# EAGLE design gator-bit (EAGLE 9.5.2)

## Sheet 1 of 2
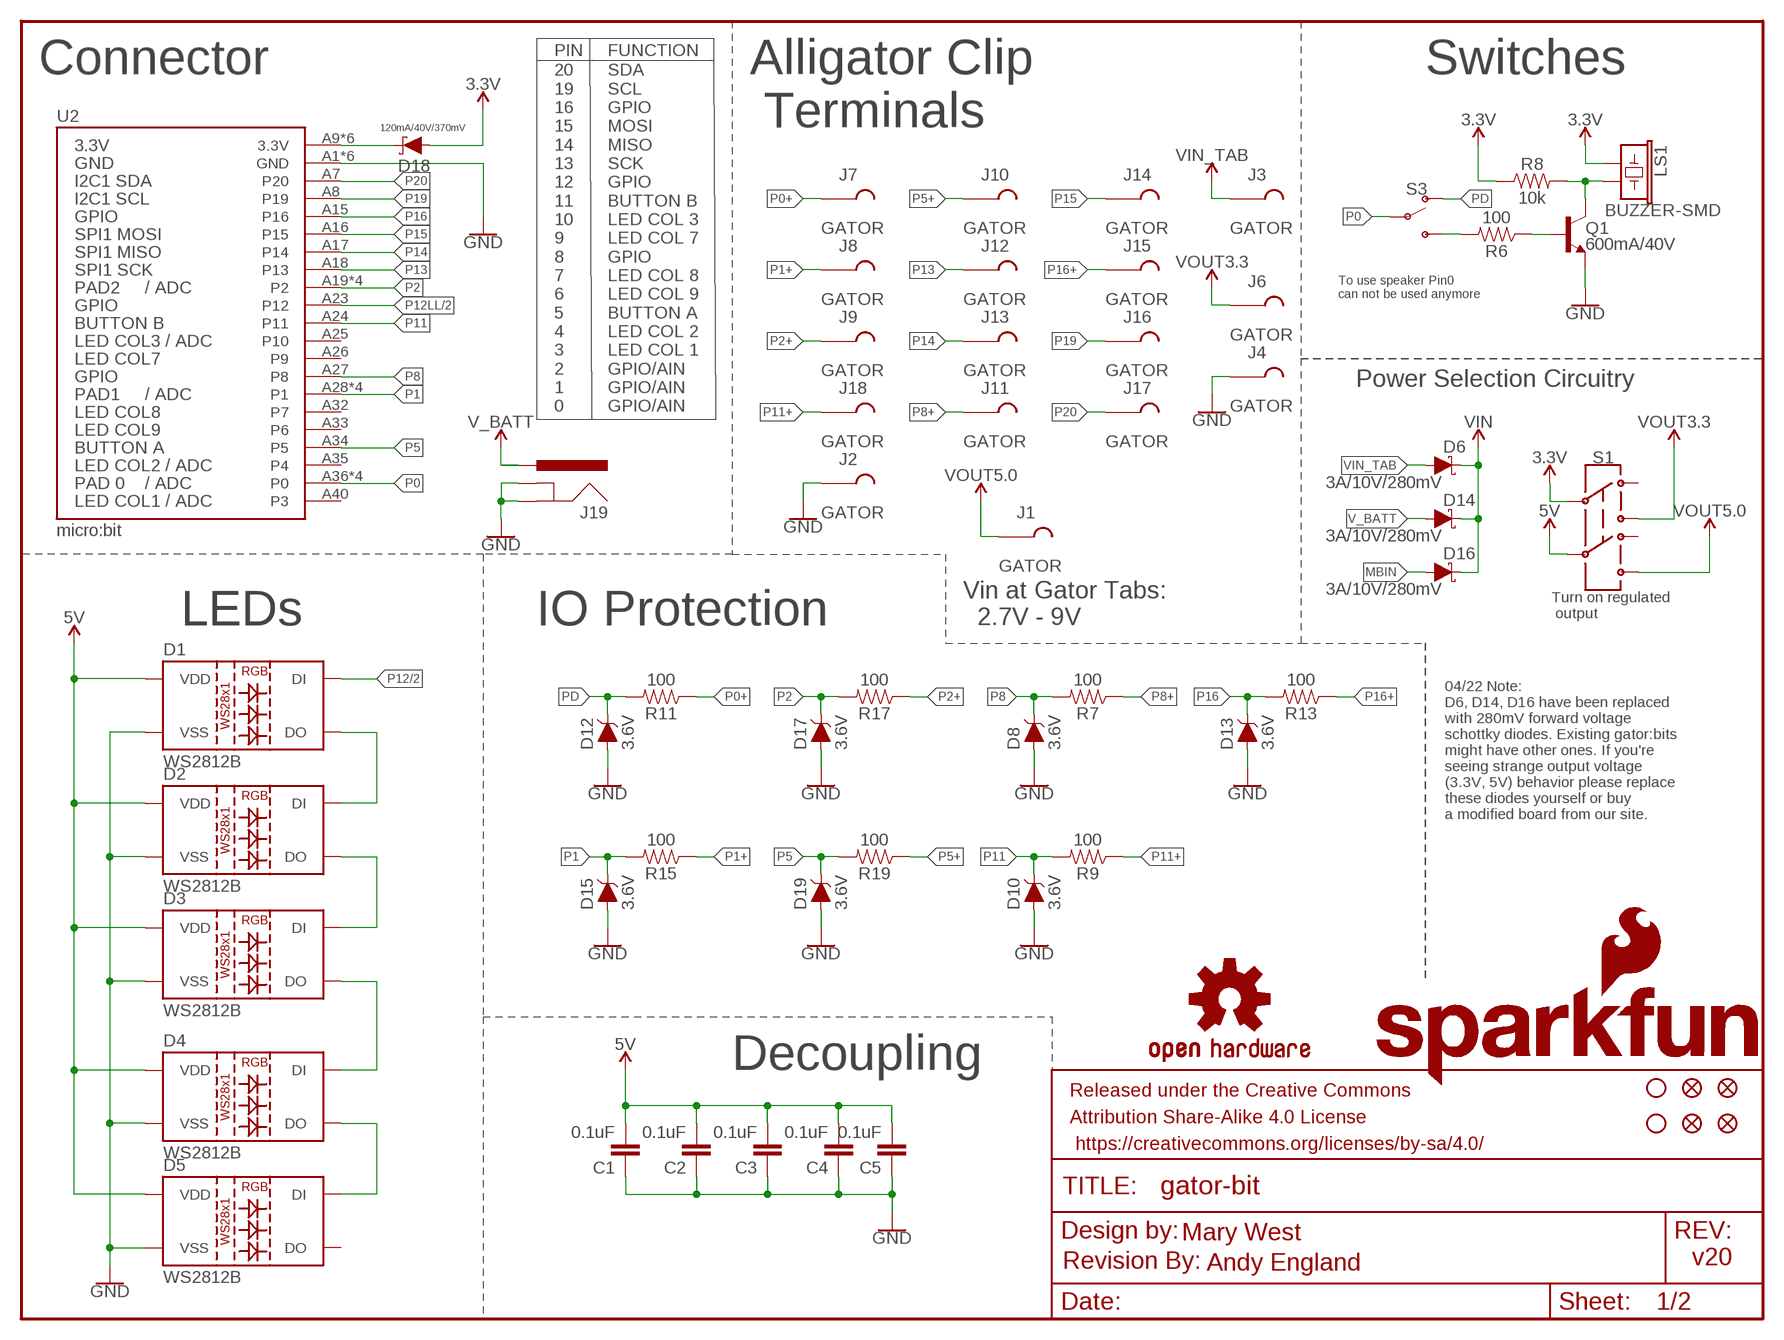
[diagram p0: schematic, sheet 1]

### Parts
C1  0.1uF  0.1UF-0603-25V-(+80/-20%)  [0603]
C2  0.1uF  0.1UF-0603-25V-(+80/-20%)  [0603]
C3  0.1uF  0.1UF-0603-25V-(+80/-20%)  [0603]
C4  0.1uF  0.1UF-0603-25V-(+80/-20%)  [0603]
C5  0.1uF  0.1UF-0603-25V-(+80/-20%)  [0603]
D1  WS2812B  [WS2812B]
D2  WS2812B  [WS2812B]
D3  WS2812B  [WS2812B]
D4  WS2812B  [WS2812B]
D5  WS2812B  [WS2812B]
D6  3A/10V/280mV  DIODE-SCHOTTKY-BAT60A  [SOD-323]
D8  3.6V  DIODE-ZENER-BZT52C3V6S  [SOD-323]
D10  3.6V  DIODE-ZENER-BZT52C3V6S  [SOD-323]
D12  3.6V  DIODE-ZENER-BZT52C3V6S  [SOD-323]
D13  3.6V  DIODE-ZENER-BZT52C3V6S  [SOD-323]
D14  3A/10V/280mV  DIODE-SCHOTTKY-BAT60A  [SOD-323]
D15  3.6V  DIODE-ZENER-BZT52C3V6S  [SOD-323]
D16  3A/10V/280mV  DIODE-SCHOTTKY-BAT60A  [SOD-323]
D17  3.6V  DIODE-ZENER-BZT52C3V6S  [SOD-323]
D18  120mA/40V/370mV  DIODE-SCHOTTKY-RB751S40  [SOD-523]
D19  3.6V  DIODE-ZENER-BZT52C3V6S  [SOD-323]
FD1  FIDUCIAL1X2  [FIDUCIAL-1X2]
FD2  FIDUCIAL1X2  [FIDUCIAL-1X2]
FD3  FIDUCIAL1X2  [FIDUCIAL-1X2]
FD4  FIDUCIAL1X2  [FIDUCIAL-1X2]
FRAME1  FRAME-LETTER  [CREATIVE_COMMONS]
H1  STAND-OFF  [STAND-OFF]
H2  STAND-OFF  [STAND-OFF]
J1  GATOR  [GATOR]
J2  GATOR  [GATOR]
J3  GATOR  [GATOR]
J4  GATOR  [GATOR]
J6  GATOR  [GATOR]
J7  GATOR  [GATOR]
J8  GATOR  [GATOR]
J9  GATOR  [GATOR]
J10  GATOR  [GATOR]
J11  GATOR  [GATOR]
J12  GATOR  [GATOR]
J13  GATOR  [GATOR]
J14  GATOR  [GATOR]
J15  GATOR  [GATOR]
J16  GATOR  [GATOR]
J17  GATOR  [GATOR]
J18  GATOR  [GATOR]
J19  POWER_JACKPTH_LOCK  [POWER_JACK_PTH_LOCK]
LOGO1  SFE_LOGO_NAME_FLAME.3_INCH  [SFE_LOGO_NAME_FLAME_.3]
LOGO2  OSHW-LOGOM  [OSHW-LOGO-M]
LOGO3  REVISION  [REVISION]
LS1  BUZZER-SMD  [BUZZER-CCV]
Q1  600mA/40V  TRANS_NPN-MMBT2222AL  [SOT23-3]
R6  100  100OHM-0603-1/10W-1%  [0603]
R7  100  100OHM-0603-1/10W-1%  [0603]
R8  10k  10KOHM-0603-1/10W-1%  [0603]
R9  100  100OHM-0603-1/10W-1%  [0603]
R11  100  100OHM-0603-1/10W-1%  [0603]
R13  100  100OHM-0603-1/10W-1%  [0603]
R15  100  100OHM-0603-1/10W-1%  [0603]
R17  100  100OHM-0603-1/10W-1%  [0603]
R19  100  100OHM-0603-1/10W-1%  [0603]
S1  SWITCH-DPDT-SMD-AYZ0202  [SWITCH_DPDT_SMD_AYZ0202]
S3  SWITCH-SPDT-SMD-AYZ0202  [SWITCH_DPDT_SMD_AYZ0202]
U2  micro:bit  MICRO:BITLEDS_UP  [MICRO:BIT_RA_PTH]

### Nets
3.3V: D18.A LS1.+ R8.1 S1.2 ; also sheet 2
5V: C1.2 C2.2 C3.2 C4.2 C5.2 D1.1(VDD) D2.1(VDD) D3.1(VDD) D4.1(VDD) D5.1(VDD) S1.5 ; also sheet 2
GND: C1.1 C2.1 C3.1 C4.1 C5.1 D1.3(VSS) D2.3(VSS) D3.3(VSS) D4.3(VSS) D5.3(VSS) D8.A D10.A D12.A D13.A D15.A D17.A D19.A J2.P$1 J2.P$2 J4.P$1 J4.P$2 J19.GND J19.GNDBREAK Q1.2(E) U2.A1(GND) U2.A2(GND) U2.A3(GND) U2.A4(GND) U2.A5(GND) U2.A6(GND) ; also sheet 2
MBIN: D16.A D18.C U2.A9(3.3V) U2.A10(3.3V) U2.A11(3.3V) U2.A12(3.3V) U2.A13(3.3V) U2.A14(3.3V)
N$3: LS1.- Q1.3(C) R8.2
N$4: D1.2(DO) D2.4(DI)
N$5: D2.2(DO) D3.4(DI)
N$6: D3.2(DO) D4.4(DI)
N$7: D4.2(DO) D5.4(DI)
N$20: R6.2 S3.3(S)
N$25: Q1.1(B) R6.1
P0: S3.2(P) U2.A36(P0) U2.A37(P0) U2.A38(P0) U2.A39(P0)
P0+: J7.P$1 J7.P$2 R11.1
P1: D15.C R15.2 U2.A28(P1) U2.A29(P1) U2.A30(P1) U2.A31(P1)
P1+: J8.P$1 J8.P$2 R15.1
P2: D17.C R17.2 U2.A19(P2) U2.A20(P2) U2.A21(P2) U2.A22(P2)
P2+: J9.P$1 J9.P$2 R17.1
P5: D19.C R19.2 U2.A34(P5)
P5+: J10.P$1 J10.P$2 R19.1
P8: D8.C R7.2 U2.A27(P8)
P8+: J11.P$1 J11.P$2 R7.1
P11: D10.C R9.2 U2.A24(P11)
P11+: J18.P$1 J18.P$2 R9.1
P12: D1.4(DI) ; also sheet 2
P12LL: U2.A23(P12) ; also sheet 2
P13: J12.P$1 J12.P$2 U2.A18(P13)
P14: J13.P$1 J13.P$2 U2.A17(P14)
P15: J14.P$1 J14.P$2 U2.A16(P15)
P16: D13.C R13.2 U2.A15(P16)
P16+: J15.P$1 J15.P$2 R13.1
P19: J16.P$1 J16.P$2 U2.A8(P19)
P20: J17.P$1 J17.P$2 U2.A7(P20)
PD: D12.C R11.2 S3.1(O)
V_BATT: D14.A J19.PWR
VIN: D6.C D14.C D16.C ; also sheet 2
VIN_TAB: D6.A J3.P$1 J3.P$2
VOUT3.3: J6.P$1 J6.P$2 S1.3 ; also sheet 2
VOUT5.0: J1.P$1 J1.P$2 S1.6 ; also sheet 2
Unconnected: D5.2(DO) S1.1 S1.4 U2.A25(P10) U2.A26(P9) U2.A32(P7) U2.A33(P6) U2.A35(P4) U2.A40(P3)

### Notes on the sheet
- PIN | FUNCTION
- Connector | Switches
- Alligator Clip
   Terminals
- To use speaker Pin0 
  can not be used anymore
- Power Selection Circuitry
- 20
  19
  16
  15
  14
  13
  12
  11
  10
  9
  8
  7
  6
  5
  4
  3
  2
  1
  0
- SDA
  SCL
  GPIO
  MOSI
  MISO
  SCK
  GPIO
  BUTTON B
  LED COL 3
  LED COL 7
  GPIO
  LED COL 8
  LED COL 9
  BUTTON A
  LED COL 2
  LED COL 1
  GPIO/AIN
  GPIO/AIN
  GPIO/AIN
- Turn on regulated
   output
- LEDs | IO Protection
- Vin at Gator Tabs:
    2.7V - 9V
- 04/22 Note:
  D6, D14, D16 have been replaced 
  with 280mV forward voltage 
  schottky diodes. Existing gator:bits 
  might have other ones. If you're 
  seeing strange output voltage 
  (3.3V, 5V) behavior please replace 
  these diodes yourself or buy
  a modified board from our site.
- Decoupling
- Mary West
- Andy England | v20

## Sheet 2 of 2
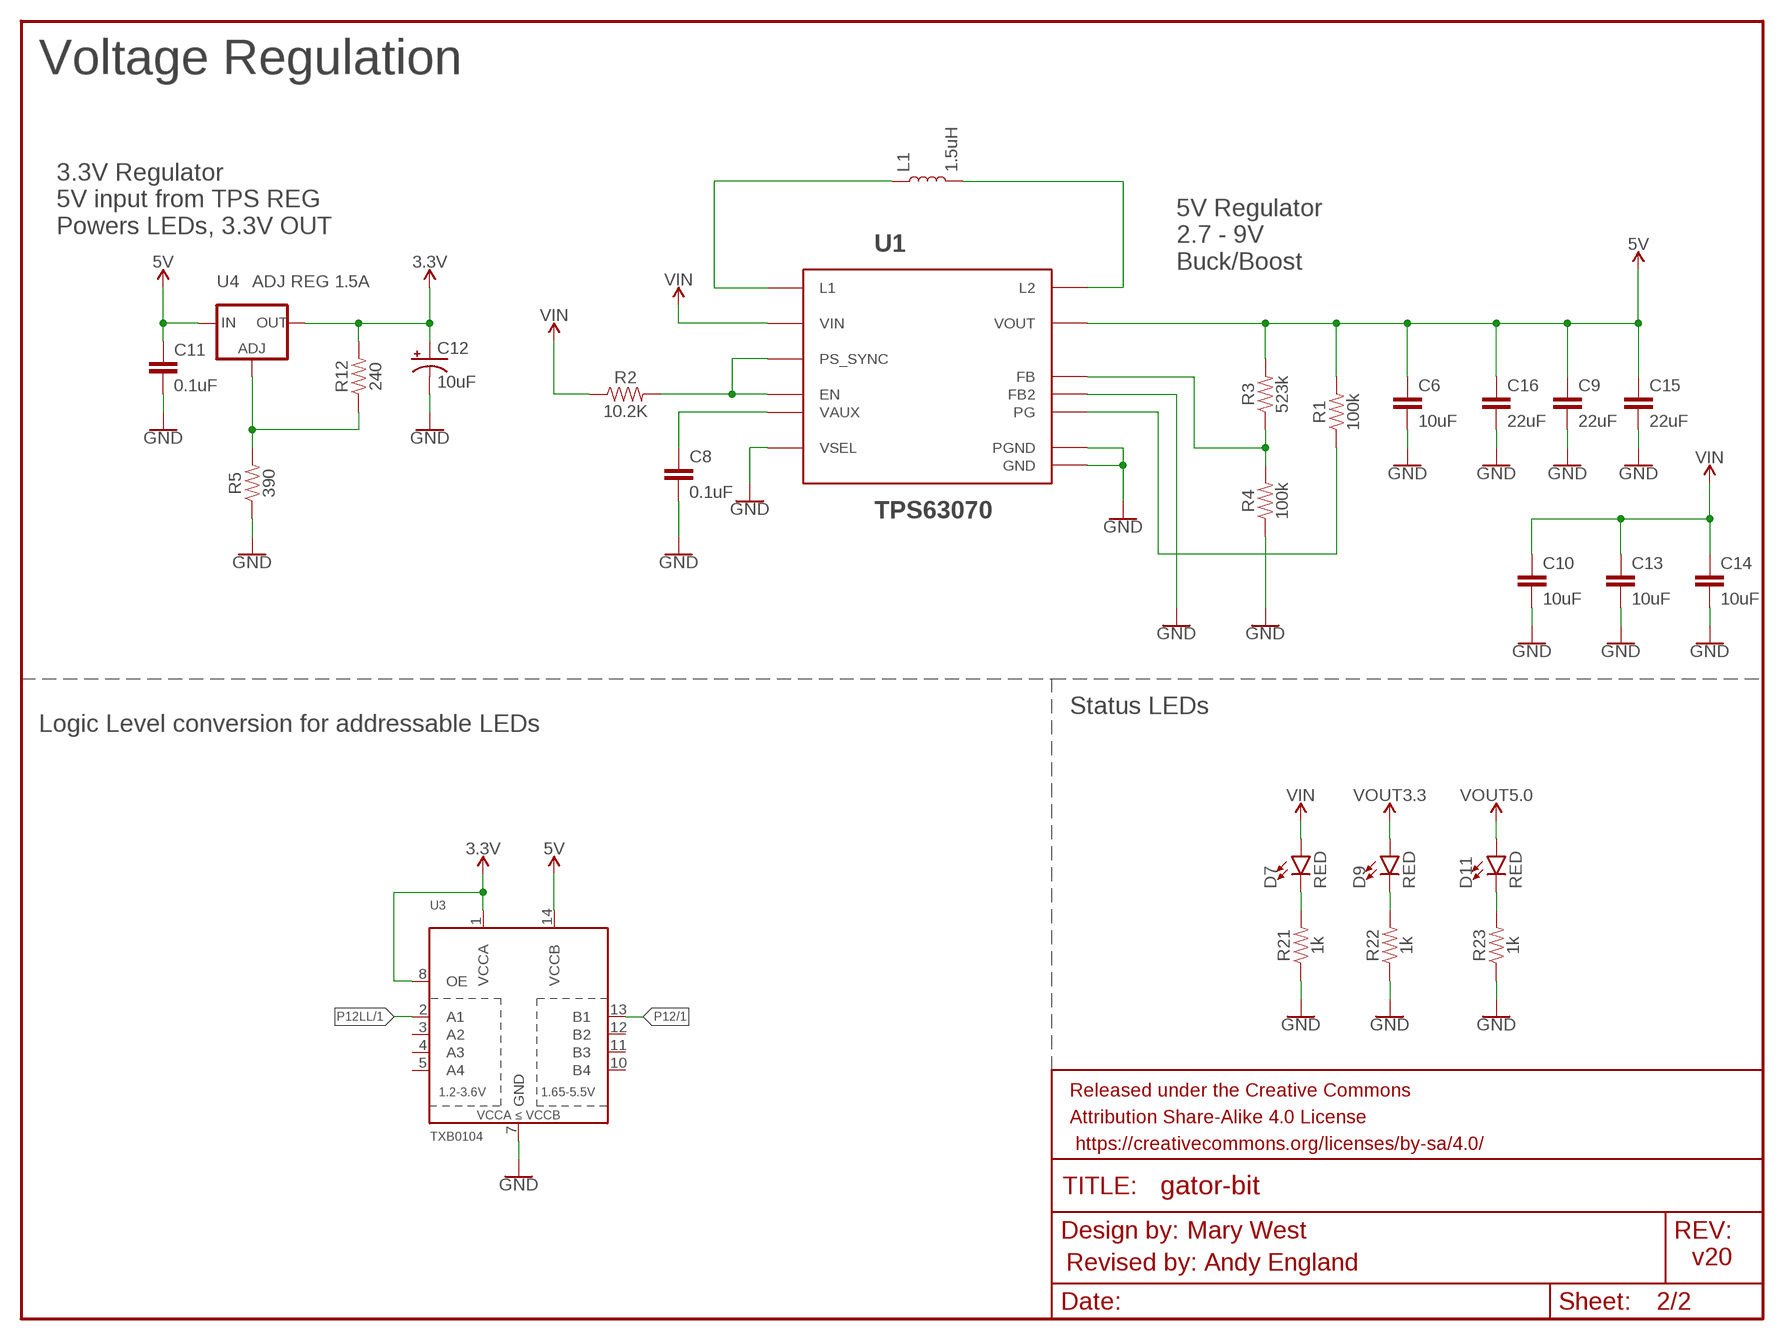
[diagram p1: schematic, sheet 2]

### Parts
C6  10uF  10UF-0603-6.3V-20%  [0603]
C8  0.1uF  0.1UF-0603-25V-(+80/-20%)  [0603]
C9  22uF  22UF-0805-6.3V-20%  [0805]
C10  10uF  10UF-0805-10V-10%  [0805]
C11  0.1uF  0.1UF-0603-25V-(+80/-20%)  [0603]
C12  10uF  10UF-POLAR-EIA3216-16V-10%(TANT)  [EIA3216]
C13  10uF  10UF-0805-10V-10%  [0805]
C14  10uF  10UF-0603-6.3V-20%  [0603]
C15  22uF  22UF-0805-6.3V-20%  [0805]
C16  22uF  22UF-0805-6.3V-20%  [0805]
D7  RED  LED-RED0603  [LED-0603]
D9  RED  LED-RED0603  [LED-0603]
D11  RED  LED-RED0603  [LED-0603]
FRAME3  FRAME-LETTER  [CREATIVE_COMMONS]
L1  1.5uH  INDUCTOR-XFL40201.5UH  [XFL4020]
R1  100k  100KOHM-0603-1/10W-1%  [0603]
R2  10.2K  10.2KOHM  [0603]
R3  523k  523KOHMOHMS-0603-1/10W-1%  [0603]
R4  100k  100KOHM-0603-1/10W-1%  [0603]
R5  390  390OHM-0603-1/10W-1%  [0603]
R12  240  240OHM-0603-1/10W-1%  [0603]
R21  1k  1KOHM-0603-1/10W-1%  [0603]
R22  1k  1KOHM-0603-1/10W-1%  [0603]
R23  1k  1KOHM-0603-1/10W-1%  [0603]
U1  TPS63070  TPS63070RNM  [TPS63070RNM]
U3  TXB0104  TXB0104PWR  [TSSOP14]
U4  ADJ REG 1.5A  GATORBIT_LM317  [SOT223]

### Nets
3.3V: C12.+ R12.2 U3.1(VCCA) U3.8(OE) U4.2(OUT) U4.4(OUT) ; also sheet 1
5V: C6.1 C9.1 C11.1 C15.1 C16.1 R1.2 R3.2 U1.P$7(VOUT) U3.14(VCCB) U4.3(IN) ; also sheet 1
GND: C6.2 C8.2 C9.2 C10.2 C11.2 C12.- C13.2 C14.2 C15.2 C16.2 R4.1 R5.1 R21.1 R22.1 R23.1 U1.P$4(GND) U1.P$6(FB2) U1.P$10(PGND) U1.P$15(VSEL) U3.7(GND) ; also sheet 1
N$2: L1.P$1 U1.P$11(L1)
N$8: L1.P$2 U1.P$9(L2)
N$9: D7.C R21.2
N$11: R3.1 R4.2 U1.P$5(FB)
N$12: C8.1 U1.P$3(VAUX)
N$13: R2.2 U1.P$1(PS_SYNC) U1.P$14(EN)
N$14: R1.1 U1.P$2(PG)
N$16: R5.2 R12.1 U4.1(ADJ)
N$23: D9.C R22.2
N$24: D11.C R23.2
P12: U3.13(B1) ; also sheet 1
P12LL: U3.2(A1) ; also sheet 1
VIN: C10.1 C13.1 C14.1 D7.A R2.1 U1.P$12(VIN) ; also sheet 1
VOUT3.3: D9.A ; also sheet 1
VOUT5.0: D11.A ; also sheet 1
Unconnected: U3.3(A2) U3.4(A3) U3.5(A4) U3.10(B4) U3.11(B3) U3.12(B2)

### Notes on the sheet
- Voltage Regulation
- 3.3V Regulator
  5V input from TPS REG
  Powers LEDs, 3.3V OUT
- 5V Regulator
  2.7 - 9V
  Buck/Boost
- Status LEDs
- Logic Level conversion for addressable LEDs
- Mary West
- Revised by: Andy England | v20

## Library data of the parts
C1-C5 C8 C11 = SparkFun-Capacitors:0.1UF: 0.1µF ceramic capacitors A capacitor is a passive two-terminal electrical component used to store electrical energy temporarily in an electric field.; PROD_ID: CAP-00810
C6 C14 = SparkFun-Capacitors:10UF: 10.0µF ceramic capacitors A capacitor is a passive two-terminal electrical component used to store electrical energy temporarily in an electric field.; PROD_ID: CAP-11015
C9 C15 C16 = SparkFun-Capacitors:22UF: 22µF ceramic capacitors A capacitor is a passive two-terminal electrical component used to store electrical energy temporarily in an electric field.; PROD_ID: CAP-08402
C10 C13 = SparkFun-Capacitors:10UF: 10.0µF ceramic capacitors A capacitor is a passive two-terminal electrical component used to store electrical energy temporarily in an electric field.; PROD_ID: CAP-11330
C12 = SparkFun-Capacitors:10UF-POLAR: 10.0µF polarized capacitors A capacitor is a passive two-terminal electrical component used to store electrical energy temporarily in an electric field.; PROD_ID: CAP-00811
D1-D5 = SparkFun-LED:WS2812B: WS2812B SMD addressable RGB LED 5x5mm SMD LED with built-in controller IC. Color: Red/Green/Blue mC Rating: RGB: 390, 660, 180 mcd Forward Voltage: RGB: 2.0, 3.0, 3.0 V Packages:WS2812B SparkFun Products: Blynk Board - ESP8266 <https://www.sparkfun.com/products/13794>; PROD_ID: DIO-12503
D6 D14 D16 = SparkFun-DiscreteSemi:DIODE-SCHOTTKY: Schottky diode A Schottky diode is a semiconductor diode which has a low forward voltage drop and a very fast switching action.; PROD_ID: DIO-14072
D7 D9 D11 = SparkFun-LED:LED-RED: Red SMD LED Used in manufacturing of most products at SparkFun Packages: 0603 - SMD 0603 package [Product Link] <http://docs.avagotech.com/docs/AV02-0551EN> 0603 SMART - SMD 0603 SMART package ( more efficient and expensive)[Product Link] <http://www.osram-os.com/Graphics/XPic2/00077099_0.pdf> 1206 - SMD1206 package [Product Link] <https://www.sparkfun.com/datasheets/DevTools/LilyPad/Q150OVS4.pdff> SparkFun Products: Pro Mini 328 -5V <https://www.sparkfun.com/products/821> RedBoard <https://www.sparkfun.com/products/12757> IOIO-OTG <https://www.sparkfun.com/products/13613>; PROD_ID: DIO-00819
D8 D10 D12 D13 D15 D17 D19 = SparkFun-DiscreteSemi:DIODE-ZENER: Zener Diode A Zener diode allows current to flow from its anode to its cathode like a normal semiconductor diode, but it also permits current to flow in the reverse direction when its "Zener voltage" is reached. - WIkipedia; PROD_ID: DIO-08199
D18 = SparkFun-DiscreteSemi:DIODE-SCHOTTKY: Schottky diode A Schottky diode is a semiconductor diode which has a low forward voltage drop and a very fast switching action.; PROD_ID: DIO-11018
FD1-FD4 = SparkFun-Aesthetics:FIDUCIAL: Fiducial Alignment Points Point-of-reference for pick-and-place machines and other optical instruments.
FRAME1 FRAME3 = SparkFun-Aesthetics:FRAME-LETTER: Schematic Frame - Letter Standard 8.5x11 US Letter frame
H1 H2 = SparkFun-Hardware:STAND-OFF: Stand Off Drill holes for mechanically mounting via screws, standoffs, etc. Note: Use the keepout ring to avoid running the screw head into surrounding components. Variant Overviews STAND-OFF - Mechanical footprint for a #4 phillips button head screw. STAND-OFF-TIGHT - Mechanical footprint for a #4 phillips button head screw, Example SparkFun Products Screw - Phillips Head (1/4", 4-40, 10 pack) (PRT-10453) Screw - Phillips Head (1/2", 4-40, 10 pack) (PRT-10452) Screw - Phillips Head (3/4", 4-40, 10 pack) (PRT-10451) Screw - Phillips Head (1", 4-40, 10 pack) (PRT-10450)
J1-J4 J6-J18 = TAB:GATOR
J19 = SparkFun-Connectors:POWER_JACK: Power Jack Connector This is the standard 5.5mm barrel jack for power. The PTH is the most common, proven, reliable, footprint. The Slot footprint only works if the mill layer is transmitted to the PCB fab house so be warned. Here are the connectors we sell at SparkFun: DC Barrel Power Jack/Connector (PRT-00119) DC Barrel Power Jack/Connector (SMD) (PRT-12748) DC Barrel Jack Adapter - Breadboard Compatible (PRT-10811) It is used on this SparkFun product (and many, many others): SparkFun RedBoard - Programmed with Arduino (DEV-12757) Also, if you need a mating power supply or connector, please check these out: Wall Adapter Power Supply - 9VDC 650mA (TOL-00298) DC Barrel Jack Adapter - Male (PRT-10287); PROD_ID: CONN-08197; SF_ID: PRT-00119
L1 = SparkFun-Coils:INDUCTOR-XFL4020; PROD_ID: INDUC-13855
LOGO1 = SparkFun-Aesthetics:SFE_LOGO_NAME_FLAME: SparkFun Font Logo w/ Flame This is the SparkFun full logo. The logo on the schematic will always be the same size; the package variant is the height of the flame part of the logo. Default layer for the logo on the board is tSilk.
LOGO2 = SparkFun-Aesthetics:OSHW-LOGO: Open-Source Hardware (OSHW) Logo This logo indicates the piece of hardware it is found on incorporates a OSHW license and/or adheres to the definition of open source hardware found here: http://freedomdefined.org/OSHW
LOGO3 = SparkFun-Aesthetics:REVISION: "Revision By" Text Preceding text for revisor documentation. Includes schematic text on "symbols" layer, and board text on tDoc.
LS1 = SparkFun-Electromechanical:BUZZER: Buzzer Small round buzzers that operate around the audible 2kHz range. You can use these as speakers to create simple music or user interfaces. Variant Overview: PTH - Mini Speaker - PC Mount 12mm 2.048kHz PTH_KIT - Mini Speaker - PC Mount 12mm 2.048kHz KIT simplifies soldering by adding stop mask to one side of the pads. PTH_NO_SILK - Mini Speaker - PC Mount 12mm 2.048kHz No silkscreen indicator of buzzer outline. PTH_KIT_NO_SILK - Mini Speaker - PC Mount 12mm 2.048kHz KIT package w/o silkscreen SMD - Buzzer Audio Magnetic (CCV-084B16) SMD buzzer used on, e.g. the LilyPad Buzzer and RFID USB Reader. SMD_KIT - Buzzer Audio Magnetic (CCV-084B16) SMD Buzzer with elongated pins to make soldering easier. Used on the SparkFun Simon Says - Surface Mount Soldering Kit.; PROD_ID: COMP-08568
Q1 = SparkFun-DiscreteSemi:TRANS_NPN: NPN transistor Current controlled devices typically used to amplify current or used as a switch. BC547 - COM-08928 (TO-92 45V 100mA) (1.Collector 2.Base 3.Emitter) 2N3904 - COM-00521 (TO-92 40V 200mA) (1.Emitter 2.Base 3.Collector) P2N2222A - COM-12852 (TO-92 40V 600mA) (1.Collector 2.Base 3.Emitter); PROD_ID: TRANS-08049
R1 R4 = SparkFun-Resistors:100KOHM: 100kΩ resistor A resistor is a passive two-terminal electrical component that implements electrical resistance as a circuit element. Resistors act to reduce current flow, and, at the same time, act to lower voltage levels within circuits. - Wikipedia; PROD_ID: RES-07828
R2 = SparkFun-Resistors:10.2KOHM: https://www.digikey.com/product-detail/en/yageo/RC0603FR-0710K2L/311-10.2KHRTR-ND/726883; PROD_ID: RES-13856
R3 = SparkFun-Resistors:523KOHM; PROD_ID: RES-13864
R5 = SparkFun-Resistors:390OHM: 390Ω resistor A resistor is a passive two-terminal electrical component that implements electrical resistance as a circuit element. Resistors act to reduce current flow, and, at the same time, act to lower voltage levels within circuits. - Wikipedia; PROD_ID: RES-07864
R6 R7 R9 R11 R13 R15 R17 R19 = SparkFun-Resistors:100OHM: 100Ω resistor A resistor is a passive two-terminal electrical component that implements electrical resistance as a circuit element. Resistors act to reduce current flow, and, at the same time, act to lower voltage levels within circuits. - Wikipedia; PROD_ID: RES-07863
R8 = SparkFun-Resistors:10KOHM: 10kΩ resistor A resistor is a passive two-terminal electrical component that implements electrical resistance as a circuit element. Resistors act to reduce current flow, and, at the same time, act to lower voltage levels within circuits. - Wikipedia; PROD_ID: RES-00824
R12 = SparkFun-Resistors:240OHM: 240Ω resistor A resistor is a passive two-terminal electrical component that implements electrical resistance as a circuit element. Resistors act to reduce current flow, and, at the same time, act to lower voltage levels within circuits. - Wikipedia; PROD_ID: RES-07849
R21-R23 = SparkFun-Resistors:1KOHM: 1kΩ resistor A resistor is a passive two-terminal electrical component that implements electrical resistance as a circuit element. Resistors act to reduce current flow, and, at the same time, act to lower voltage levels within circuits. - Wikipedia; PROD_ID: RES-07856
S1 = SparkFun-Switches:SWITCH-DPDT: Double-Pole, Double-Throw (DPDT) Switch Double-pole, double-throw switches. Variant Overview PTH-GPI-152-3013 Used on SparkFun Geiger Counter SMD-AY0202 Surface Mount DPDT Switch (COM-00597) Used on e.g. LilyPad Arduino USB - ATmega32U4 Board; PROD_ID: SWCH-08179; SF_SKU: COM-00597
S3 = SparkFun-Switches:SWITCH-SPDT: Single Pole, Double Throw (SPDT) Switch Single-pole, double-throw (SPDT) switch. Variant Overview SMD-AYZ0202 Surface Mount DPDT Switch (COM-00597) Used on e.g. LilyPad Arduino USB - ATmega32U4 Board PTH-11.6X4.0MM SPDT Mini Power Switch (COM-00102) Used on e.g. SparkFun Simon Says - Through-Hole Soldering Kit (KIT-10547) PTH-11.6X4.0MM-KIT KIT version of SPDT Mini Power Switch - Simplifies soldering by removing tStop of switch pins - only one side can be soldered. PTH-11.6X4.0MM-LOCK LOCK version of SPDT Mini Power Switch - Offset pins hold switch in place for easier soldering. SMD-RIGHT-ANGLE Surface Mount Right Angle Switch (COM-10860) Used on e.g. SparkFun ESP8266 Thing; PROD_ID: SWCH-08179; SF_ID: COM-00597
U1 = SparkFun-IC-Power:TPS63070RNM: The TPS6307x is a high efficiency, low quiescent current buck-boost converter suitable for applications where the input voltage can be higher or lower than the output voltage. Output currents can go as high as 2 A in boost mode and in buck mode. The buck-boost converter is based on a fixed frequency, pulse-widthmodulation (PWM) controller using synchronous rectification to obtain maximum efficiency. At low load currents, the converter enters Power Save Mode to maintain high efficiency over a wide load current range. The converter can be disabled to minimize battery drain. During shutdown, the load is disconnected from the battery. The device is available in a 2.5 mm x 3 mm QFN package.; PROD_ID: IC-13858
U2 = Micro_Bit_Parts:MICRO:BIT: BBC MICRO_BIT with 5x5 LED array facing the direction noted in the variant. "UP" means away from the host board, "Down" means facing towards the host board.; PROD_ID: CONN-13452
U3 = SparkFun-IC-Comms:TXB0104PWR: 4-Bit Bi-Directional Level Shifter 1.2V-3.6V (VCCA) to 1.65V-5.5V (VCCB) bi-directional level shifter with auto direction sensing. Max data rate - VCCA 1.8V: 20Mbps (50ns), VCCA 3.3V: 100Mbps (10ns) Digikey: 296-21929-1-ND (TSSOP) Datasheet SparkFun Products SparkFun Cellular Shield - MG2639 (CEL-13120) SparkFun Level Shifting microSD Breakout (DEV-13743) SparkFun Voltage-Level Translator Breakout - TXB0104 (BOB-11771) SparkFun Block for Intel® Edison - UART (DEV-13040) SparkFun Block for Intel® Edison - Arduino (DEV-13036); PROD_ID: IC-13929
U4 = SparkFun-IC-Power:GATORBIT_LM317; PROD_ID: VREG-12029

## Board
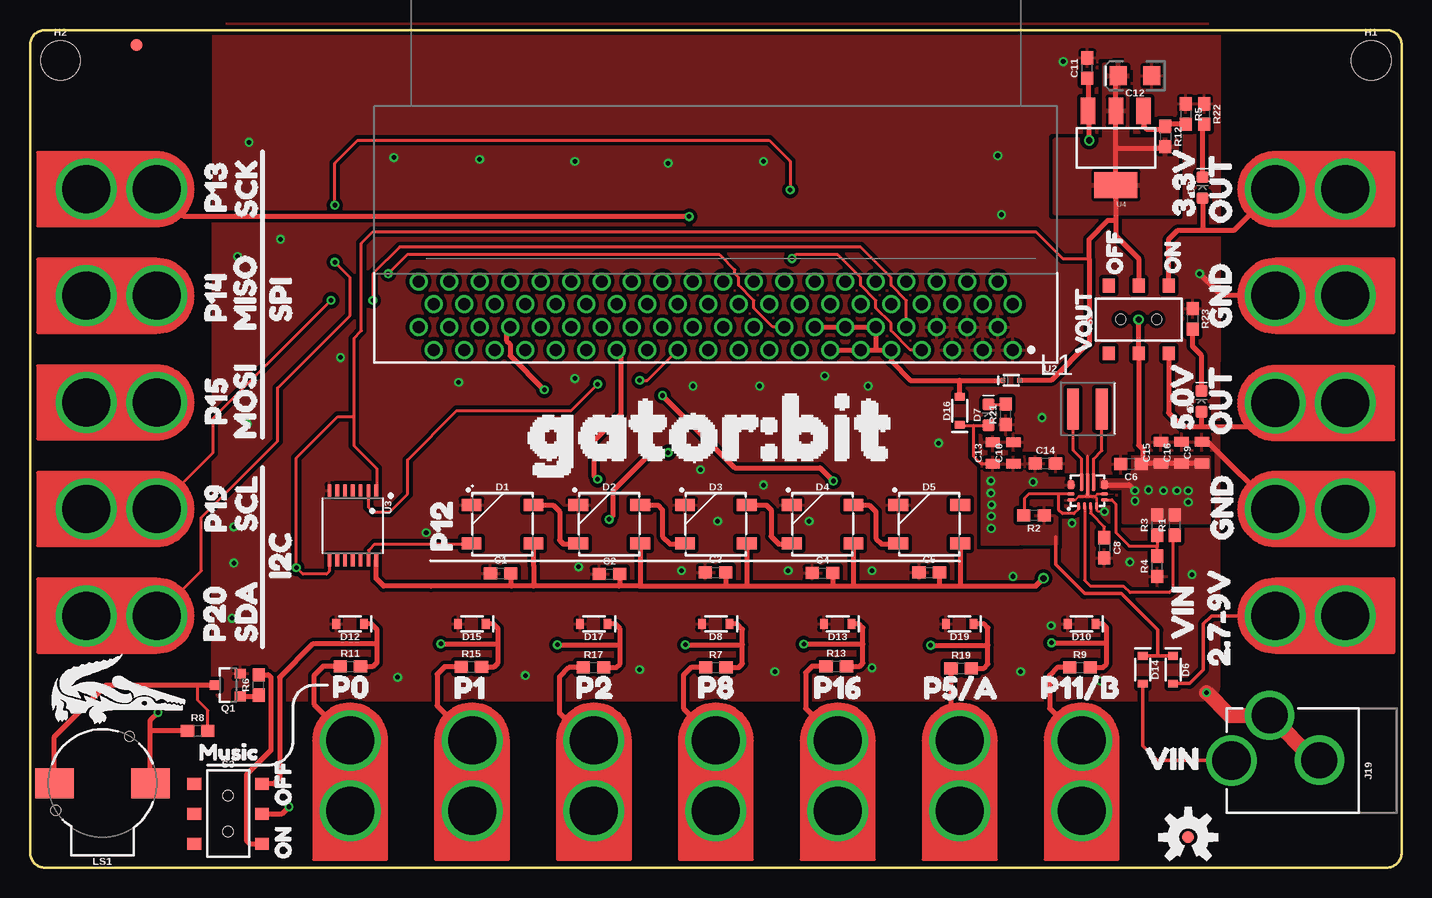
[diagram p2: board, top side]
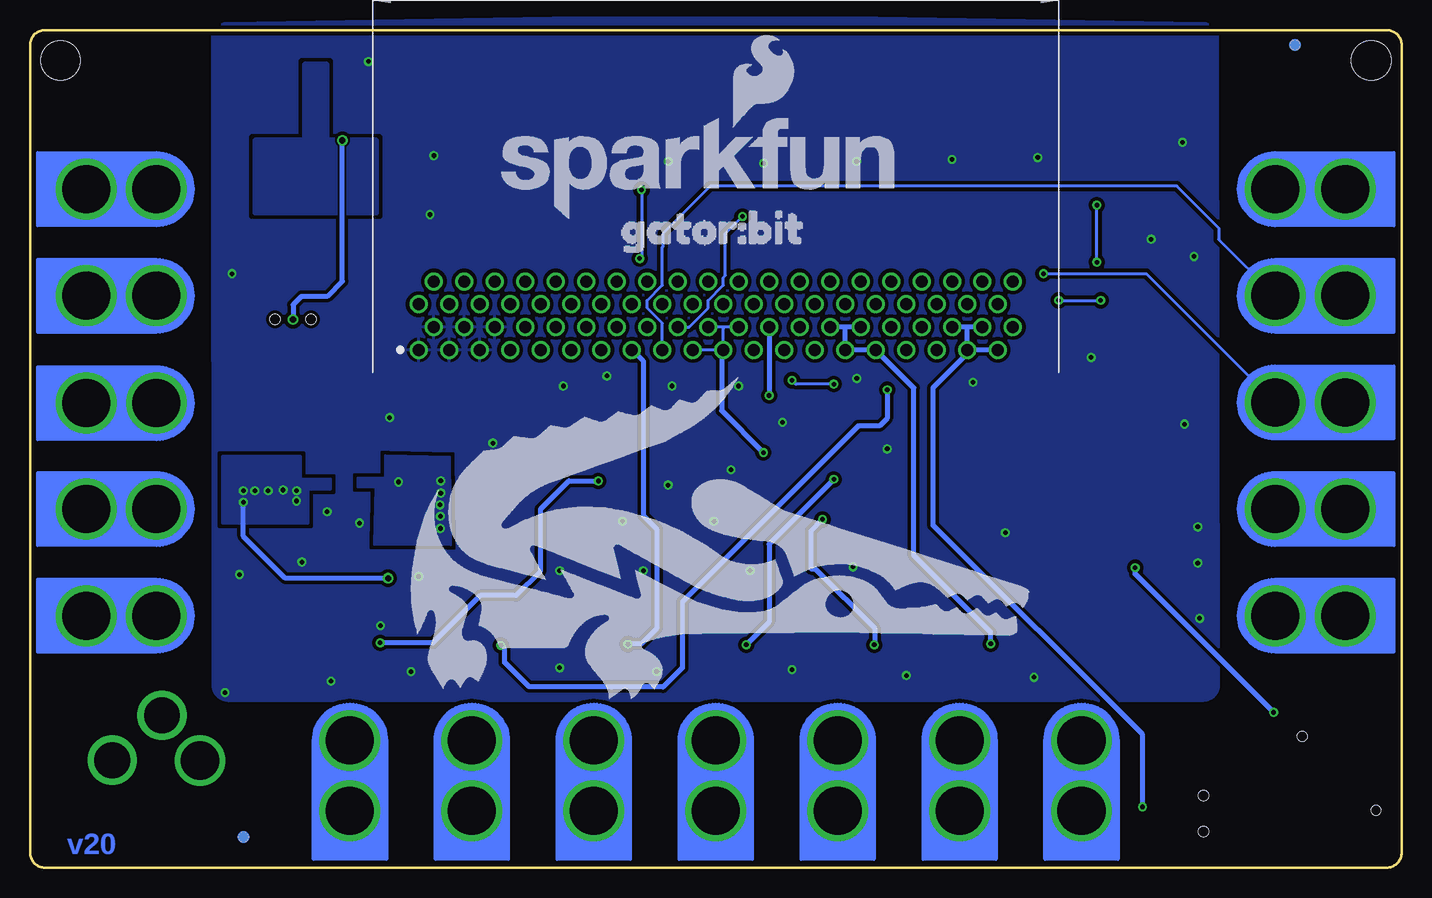
[diagram p3: board, bottom side, seen from below]

Size 114.3 x 69.85 mm. Coordinates in mm from the lower left corner, seen from the top.
Outline: 0,68.58 0,1.27 arc90 1.27,0 113.03,0 arc90 114.3,1.27 114.3,68.58 arc90 113.03,69.85 1.27,69.85 arc90 0,68.58
Copper layers (1*16): Top 0.035mm / dielectric 1.5mm / Bottom 0.035mm
Design rules "SparkFun-2-layer-TIGHT": minimum track width 7mil, minimum drill 15mil, track to track 7mil, track to pad 7mil, pad to pad 7mil, via to via 7mil, smd to smd 7mil, copper to edge 7mil, drill to drill 7mil, minimum pad ring 7mil, minimum via ring 7mil, stop-mask expansion 4mil, vias tented up to drill 25mil, thermal gap 10mil

### Footprints (pad centres in the part's own frame; a part is rotated, then mirrored left to right if it is on the bottom)
0603 = smd 1.1 x 1: 1 -0.85,0; 2 0.85,0
0805 = smd 0.8 x 1.2: 1 -0.9,0; 2 0.9,0
EIA3216 = smd 1.4 x 1.6: + 1.4,0; - -1.4,0
WS2812B = smd 1.651 x 1: 1 2.577,-1.6; 2 2.577,1.6; 3 -2.577,1.6; 4 -2.577,-1.6
SOD-323 = smd 0.63 x 0.83: A 1.15,0; C -1.15,0
LED-0603 = smd 1 x 1: A -0.877,0; C 0.877,0
SOD-523 = smd 0.4 x 0.4: A -0.7,0; C 0.7,0
FIDUCIAL-1X2 = smd 1 x 1: 1 0,0
STAND-OFF = hole 3.302: 0,0
GATOR = drill 4 pad 5.08: P$1 0,-6.096; P$2 0,-0.254
POWER_JACK_PTH_LOCK = drill 2.997 pad 4.115: GND 0.025,6.557; GNDBREAK 3.762,10.7 | drill 3.2 pad 4.115: PWR 0,13.878
XFL4020 = smd 0.98 x 3.4: P$1 1,1.8; P$2 3.4,1.8
BUZZER-CCV = smd 3.2 x 2.5: + 4,0; - -4,0 | hole 0.8: -3.9,-2.25; 2.25,3.9
SOT23-3 = smd 0.8 x 0.9: 1 -0.95,-1; 2 0.95,-1; 3 0,1.1
SWITCH_DPDT_SMD_AYZ0202 = smd 1 x 1.15: 1 -2.5,2.825; 2 0,2.825; 3 2.5,2.825; 4 -2.5,-2.825; 5 0,-2.825; 6 2.5,-2.825 | hole 0.85: 1.5,0; -1.5,0
TPS63070RNM = smd 0.6 x 0.25: P$1 0,2.145; P$2 0,1.645; P$3 0,1.145; P$4 0,0.645 | smd 0.25 x 0.6: P$5 0.5,-0.005; P$6 1,-0.005; P$14 1,2.795; P$15 0.5,2.795 | smd 0.75 x 0.6: P$7 1.757,0.006; P$12 1.768,2.794 | smd 1.45 x 0.35: P$9 1.988,0.895; P$11 1.988,1.895 | smd 1.8 x 0.35: P$10 1.812,1.395
MICRO:BIT_RA_PTH = drill 1: A1 -24.765,7.62; A2 -23.495,5.72; A3 -22.225,7.62; A4 -20.955,5.72; A5 -19.685,7.62; A6 -18.415,5.72; A7 -17.145,7.62; A8 -15.875,5.72; A9 -14.605,7.62; A10 -13.335,5.72; A11 -12.065,7.62; A12 -10.795,5.72; A13 -9.525,7.62; A14 -8.255,5.72; A15 -6.985,7.62; A16 -5.715,5.72; A17 -4.445,7.62; A18 -3.175,5.72; A19 -1.905,7.62; A20 -0.635,5.72; A21 0.635,7.62; A22 1.905,5.72; A23 3.175,7.62; A24 4.445,5.72; A25 5.715,7.62; A26 6.985,5.72; A27 8.255,7.62; A28 9.525,5.72; A29 10.795,7.62; A30 12.065,5.72; A31 13.335,7.62; A32 14.605,5.72; A33 15.875,7.62; A34 17.145,5.72; A35 18.415,7.62; A36 19.685,5.72; A37 20.955,7.62; A38 22.225,5.72; A39 23.495,7.62; A40 24.765,5.72; B1 -24.765,3.82; B2 -23.495,1.92; B3 -22.225,3.82; B4 -20.955,1.92; B5 -19.685,3.82; B6 -18.415,1.92; B7 -17.145,3.82; B8 -15.875,1.92; B9 -14.605,3.82; B10 -13.335,1.92; B11 -12.065,3.82; B12 -10.795,1.92; B13 -9.525,3.82; B14 -8.255,1.92; B15 -6.985,3.82; B16 -5.715,1.92; B17 -4.445,3.82; B18 -3.175,1.92; B19 -1.905,3.82; B20 -0.635,1.92; B21 0.635,3.82; B22 1.905,1.92; B23 3.175,3.82; B24 4.445,1.92; B25 5.715,3.82; B26 6.985,1.92; B27 8.255,3.82; B28 9.525,1.92; B29 10.795,3.82; B30 12.065,1.92; B31 13.335,3.82; B32 14.605,1.92; B33 15.875,3.82; B34 17.145,1.92; B35 18.415,3.82; B36 19.685,1.92; B37 20.955,3.82; B38 22.225,1.92; B39 23.495,3.82; B40 24.765,1.92
TSSOP14 = smd 0.305 x 0.991: 1 -1.95,-2.918; 2 -1.3,-2.918; 3 -0.65,-2.918; 4 0,-2.918; 5 0.65,-2.918; 6 1.3,-2.918; 7 1.95,-2.918; 8 1.95,2.918; 9 1.3,2.918; 10 0.65,2.918; 11 0,2.918; 12 -0.65,2.918; 13 -1.3,2.918; 14 -1.95,2.918
SOT223 = smd 1.219 x 2.235: 1 -2.311,-3.099; 2 0,-3.099; 3 2.311,-3.099 | smd 3.6 x 2.2: 4 0,3.099

### Placement (x,y rotation side)
C1  39.22,24.56 0 top
C2  48.29,24.49 0 top
C3  57.13,24.62 0 top
C4  66.05,24.56 0 top
C5  74.94,24.62 0 top
C6  91.76,33.66 180 top
C8  89.54,26.67 270 top
C9  97.65,34.61 90 top
C10  81.95,34.58 90 top
C11  88.11,66.67 90 top
C12  92.08,66.04 180 top
C13  80.23,34.58 90 top
C14  84.61,33.72 0 top
C15  94.25,34.61 90 top
C16  95.96,34.61 90 top
D1  39.38,28.64 0 top
D2  48.27,28.64 0 top
D3  57.16,28.64 0 top
D4  66.05,28.64 0 top
D5  74.94,28.64 0 top
D6  95.25,16.51 270 top
D7  79.88,37.76 90 top
D8  57.15,20.32 180 top
D9  97.71,56.71 90 top
D10  87.63,20.32 180 top
D11  97.64,38.89 90 top
D12  26.67,20.32 180 top
D13  67.31,20.32 180 top
D14  92.71,16.51 270 top
D15  36.83,20.32 180 top
D16  77.47,38.1 90 top
D17  46.99,20.32 180 top
D18  81.79,40.64 180 top
D19  77.47,20.32 180 top
FD1  96.52,2.54 0 bottom
FD2  8.89,68.58 0 top
FD3  96.52,2.54 0 top
FD4  8.89,68.58 0 bottom
FRAME1  23.5,-8.26 0 top  (outside the outline)
FRAME3  23.5,-8.26 0 top  (outside the outline)
H1  111.76,67.31 0 top
H2  2.54,67.31 0 top
J1  103.51,38.73 90 top
J2  103.51,47.69 90 top
J3  103.51,21.02 90 top
J4  103.51,29.91 90 top
J6  103.51,56.58 90 top
J7  26.68,10.86 0 top
J8  36.84,10.86 0 top
J9  47,10.86 0 top
J10  77.48,10.86 0 top
J11  57.16,10.86 0 top
J12  10.8,56.58 270 top
J13  10.8,47.69 270 top
J14  10.8,38.8 270 top
J15  67.32,10.86 0 top
J16  10.8,29.91 270 top
J17  10.8,21.02 270 top
J18  87.64,10.86 0 top
J19  114,8.94 90 top
L1  85.92,36.46 0 top
LOGO1  75.57,53.98 0 bottom
LOGO2  96.52,2.54 0 top
LOGO3  35.05,-10.67 0 top  (outside the outline)
LS1  6.04,7.04 0 top
Q1  16.51,15.24 90 top
R1  95.42,28.57 90 top
R2  83.66,29.37 180 top
R3  93.94,28.57 90 top
R4  93.94,25.13 90 top
R5  96.32,62.84 270 top
R6  19.05,15.24 90 top
R7  57.15,16.69 0 top
R8  13.97,11.43 0 top
R9  87.5,16.69 0 top
R11  26.7,16.79 0 top
R12  94.62,60.96 270 top
R13  67.19,16.8 0 top
R15  36.78,16.76 0 top
R17  46.96,16.69 0 top
R19  77.6,16.64 0 top
R21  81.32,37.81 90 top
R22  97.84,62.84 270 top
R23  96.88,45.77 270 top
S1  92.39,45.72 0 top
S3  16.52,4.5 270 top
U1  89.54,30.16 90 top
U2  57.15,50.8 180 top
U3  26.9,28.52 180 top
U4  90.49,60.01 180 top
U$1  [2#7#9V21]  99.06,15.24 90 top
U$2  [3#3V25]  96.14,52.7 90 top
U$3  [5#0V23]  96.01,34.92 90 top
U$4  [ORDERING_INSTRUCTIONS]  1.78,-26.8 0 top  (outside the outline)
U$5  [GATOR#BIT26]  36.88,36.63 0 top
U$6  [GATOR#BIT32]  67.31,53.34 0 bottom
U$7  [GND22]  99.31,25.78 90 top
U$8  [GND22]  99.19,43.43 90 top
U$9  [I2C7]  20.83,22.48 90 top
U$10  [MISO5]  17.91,43.18 90 top
U$11  [MOSI4]  17.91,34.16 90 top
U$12  [MUSIC28]  12.95,9.65 0 top
U$13  [OFF29]  21.08,4.06 90 top
U$14  [ON30]  21.08,-0.38 90 top
U$15  [OUT24]  99.19,34.54 90 top
U$16  [OUT24]  99.19,52.2 90 top
U$17  [P5#A18]  72.85,14.99 0 top
U$18  [P11#B19]  82.6,15.04 0 top
U$19  [P013]  23.57,15.09 0 top
U$20  [P114]  33.71,15.01 0 top
U$21  [P130]  15.47,53.04 90 top
U$22  [P199]  15.47,26.34 90 top
U$23  [P208]  15.37,17.25 90 top
U$24  [P215]  43.87,15.04 0 top
U$25  [P816]  54.03,15.06 0 top
U$26  [P1227]  34.29,24.77 90 top
U$27  [P1411]  15.47,43.89 90 top
U$28  [P1510]  15.49,35.33 90 top
U$29  [P1617]  63.68,15.04 0 top
U$30  [SCK1]  18.01,52.65 90 top
U$31  [SCL2]  18.01,26.47 90 top
U$32  [SDA3]  18.01,17.22 90 top
U$33  [SPI6]  20.88,43.97 90 top
U$34  [VIN20]  96.04,17.48 90 top
U$35  [VOUT31]  87.78,41.76 90 top
U$36  [OFF29]  90.37,48.34 90 top
U$37  [ON30]  95.2,48.41 90 top
U$39  [VIN20]  91.39,9.09 0 top

### Tracks (layer width: path | path; a pad name or v marks a point on that pad's centre or on a via)
3.3V  (via drill 0.38)
  Top 0.254: 88.27,50.8 86.04,50.8 83.82,53.02 28.57,53.02 27.62,52.07 27.62,44.77 26.99,44.13 26.99,37.72 | 26.99,37.72 26.99,35.19 28.88,33.3 28.88,31.47 U3.1 | U3.8 24.95,24.72 24.71,24.49 22.73,24.49 v22.2,25.02 22.2,34.16 25.65,37.62 26.89,37.62 26.99,37.72
  Top 0.406: 90.49,53.98 U4.4 90.49,60.01 | 90.49,53.98 90.49,52.7 92.39,50.8 S1.2 | 90.49,53.98 89.85,53.98 88.27,52.39 88.27,50.8 88.27,43.81 85.09,40.64 D18.A | C12.+ 90.49,65.85 U4.2 90.49,60.01 | 90.49,60.01 94.51,60.01 R12.2 | v10.67,12.95 10.04,12.32 10.04,11.43 | LS1.+ 10.04,11.43 | R8.1 10.04,11.43
  Bottom 0.406: v10.67,12.95 22.2,24.49 v22.2,25.02
  pour Top (isolate 0.305): 89.54,66.99 89.54,60.64 85.41,60.64 85.41,54.61 95.57,54.61 95.57,60.64 91.44,60.64 91.44,66.99
5V  (via drill 0.38, 0.51)
  Top 0.406: C11.1 88.18,65.75 U4.3 88.27,63.02 v88.27,60.64 | 50.8,23.5 58.1,23.5 | 58.1,23.5 59.69,23.5 | 59.69,23.5 66.99,23.5 | 66.99,23.5 68.58,23.5 | 68.58,23.5 75.88,23.5 | 75.88,23.5 77.47,23.5 | 77.47,23.5 83.82,23.5 v84.45,24.13 | D1.1 41.95,25.18 41.96,25.18 41.96,23.5 | D2.1 50.84,23.54 50.8,23.5 | 58.1,23.5 57.98,23.62 C3.2 | D3.1 59.73,23.54 59.69,23.5 | C4.2 66.89,23.59 66.99,23.5 | D4.1 68.62,23.54 68.58,23.5 | C5.2 75.78,23.59 75.88,23.5 | D5.1 77.51,23.54 77.47,23.5 | C9.1 C16.1 C15.1 92.66,33.71 C6.1 92.71,33.76 92.71,34.92 92.39,35.24 S1.5 92.39,45.69 v92.38,45.71 | U1.P$7 91.59,31.92 v92.08,31.43 | 50.8,23.5 49.1,23.5 | 49.1,23.5 41.96,23.5 | 41.96,23.5 40.13,23.5 | 40.13,23.5 33.4,23.5 29.46,23.5 28.85,24.11 U3.14 | C1.2 40.07,23.55 40.13,23.5 | C2.2 49.14,23.54 49.1,23.5
  Bottom 0.406: v84.45,24.13 93.03,24.13 96.52,27.62 v96.52,30.48 | v88.27,60.64 88.27,48.9 89.53,47.62 91.69,47.62 92.38,46.93 v92.38,45.71
  other vias: 95.57,31.43 94.46,31.43 93.21,31.5 96.52,31.43 92.09,30.58
  pour Top (isolate 0.305, no thermals): 89.22,32.38 91.76,32.38 91.76,34.29 98.27,34.29 98.27,28.73 91.12,28.73 91.12,31.59 89.22,31.59
  pour Bottom: 91.12,28.73 91.12,31.59 89.22,31.59 89.22,32.38 91.76,32.38 91.76,34.29 98.27,34.29 98.27,28.73
GND  (via drill 0.38)
  Top 0.203: 88.73,30.93 88.96,31.16 U1.P$6 | 88.73,30.93 88.89,30.78 U1.P$4 88.89,29.86 88.9,29.84 88.9,29.81 89.02,29.69 v89.53,29.69 | U1.P$15 87.03,30.66 87.05,30.68 87.12,30.68 87.38,30.94 88.73,30.94 88.73,30.93
  Top 0.254: U1.P$10 88.14,34.32
  Top 0.406: J2.P$1 J2.P$2 99.32,47.69 97.63,49.37 | J4.P$1 J4.P$2 98.16,35.51 C9.2
  Top 1.27: v98.04,14.61 99.95,12.7 J19.GNDBREAK 107.04,8.96 J19.GND
  other vias: 97.47,49.53 16.99,25.4 16.83,20.8 30.64,15.88 41.28,16.03 50.8,16.51 62.07,16.35 57.31,28.89 16.99,28.42 18.26,60.48 17.3,50.96 20.87,52.41 42.86,34.92 37.47,59.05 45.4,58.9 53.18,58.74 69.85,40.16 61.12,58.9 45.4,40.8 51.59,37.15 61.12,31.91 84.33,37.53 18.1,36.99 80.65,59.37 86.11,67.21 80.96,54.45 86.84,28.73 75.72,35.4 81.92,24.29 91.65,25.49 70.17,16.67 82.55,16.35 55.88,33.18 64.93,28.89 30.32,59.21 25.88,42.55 60.8,40.16 55.25,40.16 85.09,20.18 96.84,24.45 89.22,15.56 35.72,40.48 66.23,41.01 70.17,24.77 63.18,24.77 54.29,24.77 45.72,25.08 33.02,27.94
  pour Top (isolate 0.305, rank 2): 15.24,15.24 15.3,69.12 arc-90 16.57,70.39 97.85,70.39 arc-90 99.12,69.12 99.06,15.24 arc-90 97.79,13.97 16.51,13.97 arc-90
  pour Bottom (isolate 0.305, rank 2): 15.24,15.24 15.3,69.12 arc-90 16.57,70.39 arc-3 97.85,70.39 arc-90 99.12,69.12 99.06,15.24 arc-90 97.79,13.97 16.51,13.97 arc-90
MBIN
  Top 0.406: U2.A13 U2.A11 70.48,43.18 | 70.48,43.18 U2.A9 71.75,42.23 73.34,40.64 77.47,40.64 | U2.A14 U2.A12 U2.A10 70.48,43.18 | 77.47,40.64 D18.C | D16.A 77.47,40.64
N$2
  Top 0.254: U1.P$11 87.64,34.09 86.93,34.8 86.94,34.81 86.94,38.24 L1.P$1
N$3
  Top 0.254: R8.2 14.82,13.12 13.97,13.97 13.97,15.24
  Top 0.406: LS1.- 2.04,10.93 6.35,15.24 13.97,15.24 Q1.3
N$4
  Top 0.406: D1.2 43.58,30.23 44.13,29.69 44.13,27.3 44.45,26.99 46.04,26.99 46.2,26.83 45.89,26.83 D2.4
N$5
  Top 0.406: D2.2 52.31,30.23 52.7,29.84 52.7,27.62 53.34,26.99 54.53,26.99 D3.4
N$6
  Top 0.406: D3.2 61.36,30.23 61.75,29.84 61.75,27.62 62.39,26.99 63.42,26.99 D4.4
N$7
  Top 0.406: D4.2 69.94,30.23 70.48,29.69 70.48,27.46 70.96,26.99 72.31,26.99 D5.4
N$8
  Top 0.254: U1.P$9 88.64,34.09 89.33,34.78 89.33,38.25 L1.P$2
N$9
  Top 0.254: D7.C 81.31,38.64 R21.2
N$11
  Top 0.254: U1.P$5 90.15,30.66 90.49,30.32 90.49,27.94 91.6,26.83 93.87,26.83 93.95,26.75 | R3.1 93.95,27.71 93.95,26.75 | R4.2 93.94,26.73 93.95,26.75
N$12
  Top 0.254: U1.P$3 88.39,29.56 89.53,28.42 C8.1
N$13
  Top 0.254: U1.P$1 87.39,29.92 87,29.53 86.04,29.53 85.72,29.84 85.72,31.16 | U1.P$14 85.72,31.16 | 85.72,31.16 83.23,31.16 82.87,30.8 82.87,29.43 R2.2
N$14
  Top 0.254: U1.P$2 87.89,23.96 88.36,23.5 91.12,23.5 91.68,22.94 94.94,22.94 95.26,23.25 95.26,27.57 R1.1
N$16
  Top 0.406: U4.1 92.8,61.82 93.03,61.59 94.4,61.59 R12.1 94.8,61.99 R5.2
N$20
  Top 0.406: R6.2 19.85,16.09 20.07,15.88 20.07,9.78 18.03,7.75 18.03,2.29 18.32,2 S3.3
N$22
  pour Bottom: 89.54,66.99 91.44,66.99 91.44,60.64 95.57,60.64 95.57,54.61 85.41,54.61 85.41,60.64 89.54,60.64
N$23
  Top 0.406: D9.C 97.71,61.86 R22.2
N$24
  Top 0.406: D11.C 97.64,42.7 96.88,43.46 R23.2
N$25
  Top 0.406: Q1.1 18.95,14.29 R6.1
P0  (via drill 0.38)
  Top 0.406: S3.2 21.02,4.5 v21.59,5.08
  Bottom 0.406: U2.A38 36.2,45.08 | 36.2,45.08 U2.A36 | U2.A37 36.2,45.08 | U2.A39 U2.A37 | U2.A37 36.2,42.86 39.05,40.01 39.05,28.57 21.59,11.11 v21.59,5.08
P0+
  Top 0.406: J7.P$1 J7.P$2 23.65,13.63 23.65,16 24.43,16.79 R11.1
P1  (via drill 0.38)
  Top 0.406: R15.2 38.68,16.76 39,17.08 39,18.67 | v34.24,18.67 39,18.67 | 39,18.67 39,19.93 38.61,20.32 D15.C
  Bottom 0.406: U2.A30 46.35,45.08 | 46.35,45.08 U2.A28 | 46.35,45.08 U2.A29 U2.A31 40.64,40.01 40.64,26.02 34.24,19.62 v34.24,18.67
P1+
  Top 0.406: J8.P$1 J8.P$2 33.92,13.51 33.92,16.13 34.56,16.76 R15.1
P2  (via drill 0.38)
  Top 0.406: v53.18,34.61 51.75,34.61 48.58,31.43 48.58,29.37 v48.26,29.05 | R17.2 48.87,16.69 49.19,17 49.19,18.59 | v43.95,18.59 49.19,18.59 | 49.19,18.59 49.19,19.9 48.77,20.32 D17.C
  Bottom 0.254: U2.A22 56.67,45.08 | 56.67,45.08 U2.A20 | 56.67,43.18 U2.A19 | U2.A21 56.52,44.92 56.67,45.08
  Bottom 0.406: U2.A21 56.67,43.18 56.67,38.1 v53.18,34.61 | v48.26,29.05 49.21,28.1 49.21,24.92 48.85,24.92 43.92,19.99 43.92,18.62 v43.95,18.59
P2+
  Top 0.406: J9.P$1 J9.P$2 46.87,10.48 46.51,10.48 44.13,12.86 44.13,15.92 44.9,16.69 R17.1
P5  (via drill 0.38)
  Top 0.406: v42.86,39.85 40.01,42.7 40.01,43.66 39.69,43.97 39.69,44.61 40.01,44.93 U2.A34 | R19.2 79.5,16.64 79.82,16.95 79.82,18.54 | v75.06,18.54 79.82,18.54 | 79.82,18.54 79.82,20 79.5,20.32 D19.C
  Bottom 0.406: v75.06,18.54 74.74,18.22 74.74,17.11 72.71,15.08 65.88,15.08 65.86,15.06 61.54,15.06 59.94,16.66 59.94,22.17 45.29,36.83 43.5,36.83 42.86,37.47 v42.86,39.85
P5+
  Top 0.406: J10.P$1 J10.P$2 76.75,11.33 R19.1
P8  (via drill 0.38)
  Top 0.406: U2.A27 49.21,42.86 49.21,37.78 46.99,35.56 46.99,32.7 v47.31,32.38 | R7.2 59.05,16.69 59.37,17 59.37,18.59 | v54.61,18.59 59.37,18.59 | 59.37,18.59 59.37,19.88 58.93,20.32 D8.C
  Bottom 0.406: v54.61,18.59 52.7,20.5 52.7,26.99 v47.31,32.38
P8+
  Top 0.406: J11.P$1 J11.P$2 54.45,13.3 54.45,16.05 55.09,16.69 R7.1
P11  (via drill 0.38)
  Top 0.406: v52.7,39.37 58.74,33.34 65.85,33.34 v66.94,32.24 | R9.2 89.41,16.69 89.73,17 89.73,18.59 89.73,18.8 | v85.12,18.75 89.68,18.75 89.73,18.8 | 89.73,18.8 89.73,20 89.41,20.32 D10.C
  Bottom 0.406: U2.A24 v52.7,39.37 | v66.94,32.24 66.95,32.26 69.39,32.26 71.75,29.9 71.75,24.77 73.82,22.7 76.77,22.7 80.72,18.75 v85.12,18.75
P11+
  Top 0.406: J18.P$1 J18.P$2 84.96,13.27 84.96,16.05 85.6,16.69 R9.1
P12
  Top 0.254: D1.4 36.75,26.99 28.74,26.99 28.22,26.47 28.22,25.63 U3.13
P12LL  (via drill 0.38)
  Top 0.254: v47.31,40.32 45.09,38.1 35.56,38.1 31.47,34.01 31.47,31.17 29.97,29.67 28.6,29.67 28.2,30.07 U3.2 | v50.8,40.64 51.44,40.64 U2.A23
  Bottom 0.254: v47.31,40.32 50.48,40.32 v50.8,40.64
P13  (via drill 0.38)
  Top 0.406: v54.93,54.29 12.83,54.29 J12.P$2
  Bottom 0.254: U2.A18 59.38,45.08 57.78,46.67 57.78,47.31 56.52,48.58 56.52,49.21 56.36,49.37 56.36,52.86 v54.93,54.29
  Bottom 0.406: J12.P$1 J12.P$2
P14
  Bottom 0.254: U2.A17 61.59,45.4 62.87,46.67 62.87,47.31 61.59,48.58 61.59,51.75 61.57,51.78 61.57,52.86 57.59,56.83 18.73,56.83 15.24,53.34 15.24,52.38 J13.P$2
  Bottom 0.406: J13.P$1 J13.P$2
P15  (via drill 0.38)
  Top 0.254: U2.A16 61.91,45.09 60.33,46.67 60.33,47.31 59.05,48.58 59.05,49.21 58.74,49.53 58.74,49.85 57.47,51.12 31.43,51.12 v29.84,49.53
  Bottom 0.254: v29.84,49.53 21.27,49.53 21.27,49.52 J14.P$2
  Bottom 0.406: J14.P$1 J14.P$2
P16  (via drill 0.38)
  Top 0.406: R13.2 69.15,16.8 69.41,17.06 69.41,18.64 | v64.48,18.64 69.41,18.64 | 69.41,18.64 69.41,20 69.09,20.32 D13.C
  Bottom 0.406: U2.A15 63.18,42.23 63.18,29.37 62.07,28.26 62.07,19.95 63.35,18.67 64.46,18.67 v64.48,18.64
P16+
  Top 0.406: J15.P$1 J15.P$2 64.64,13.27 64.64,16.26 65.18,16.8 R13.1
P19  (via drill 0.38)
  Top 0.254: U2.A8 73.03,47.31 71.75,48.58 71.75,49.21 69.22,51.75 30.8,51.75 28.57,49.53 v28.57,47.31 | v25.08,47.31 15.24,37.47 15.24,34.6 J16.P$2
  Top 0.406: J16.P$1 J16.P$2
  Bottom 0.254: v28.57,47.31 v25.08,47.31
P20  (via drill 0.38)
  Top 0.254: v25.4,50.48 26.67,49.21 26.67,46.04 20.64,40.01 20.64,35.56 14.29,29.21 14.29,24.77 J17.P$2 | v63.5,50.8 63.82,51.12 67.31,51.12 69.22,49.21 69.22,48.58 70.48,47.31 70.48,46.67 71.75,45.4 71.75,44.77 73.34,43.18 U2.A7 | v25.4,55.24 25.4,58.74 27.3,60.64 61.59,60.64 63.34,58.9 v63.34,56.52
  Bottom 0.254: v25.4,50.48 v25.4,55.24 | v63.34,56.52 63.34,50.96 v63.5,50.8
  Bottom 0.406: J17.P$1 9.78,21.02 10.16,20.64 10.17,20.64 J17.P$2
PD
  Top 0.406: S3.1 19.36,6.99 20.32,6.99 20.8,7.46 20.8,15.88 23.62,18.69 28.92,18.69 | R11.2 28.6,16.79 28.92,17.11 28.92,18.69 | 28.92,18.69 28.92,19.05 28.92,19.85 28.45,20.32 D12.C
V_BATT
  Top 0.305: D14.A 92.71,10.16 93.93,8.94 J19.PWR
VIN  (via drill 0.38)
  Top 0.254: 86.74,31.76 86.91,31.93 | C13.1 79.26,33.68 78.61,34.33 78.61,36.83 78.61,36.84 78.61,36.89 | 77.53,36.89 78.61,36.89 | 78.61,36.89 D7.A
  Top 0.305: D6.C 93.98,17.66 | 93.98,17.66 D14.C | 93.98,17.66 93.98,19.81 90.93,22.86 87.88,22.86 85.47,25.27 85.47,27.56
  Top 0.406: D16.C 77.53,36.89
  other vias: 80.07,32.26 80.07,31.24 80.14,30.26 80.11,29.31 80.11,28.29 83.6,32.16
  pour Top (isolate 0.305): 79.34,34.23 84.68,34.32 84.71,32.48 84.93,32.48 87,32.51 87,31.59 86.04,31.59 85.57,31.11 85.57,26.99 79.34,26.92
  pour Bottom (isolate 0.305): 79.33,34.26 84.68,34.35 84.68,32.51 87,32.51 87,31.75 85.5,31.73 85.61,26.95 79.26,26.92
VIN_TAB
  Top 0.305: J3.P$2 98.48,21.02 97.79,20.32 97.79,16.51 96.64,15.36 D6.A
  Top 0.406: J3.P$2 J3.P$1
VOUT3.3
  Top 0.254: J6.P$2 J6.P$1
  Top 0.406: S1.3 94.89,52.4 95.66,53.16 97.79,53.16 | 97.79,53.16 100.35,53.16 J6.P$2 | D9.A 97.71,53.24 97.79,53.16
VOUT5.0
  Top 0.406: S1.6 94.89,37.92 96.01,36.8 97.61,36.8 | J1.P$1 J1.P$2 101.83,36.8 97.61,36.8 | D11.A 97.62,38.02 97.62,36.82 97.61,36.8

### Text on the board
Bottom: v20
Measures: * All dimensions / are in inches
tDocu: Mary West | Andy England | Solder Mask: Black Gloss